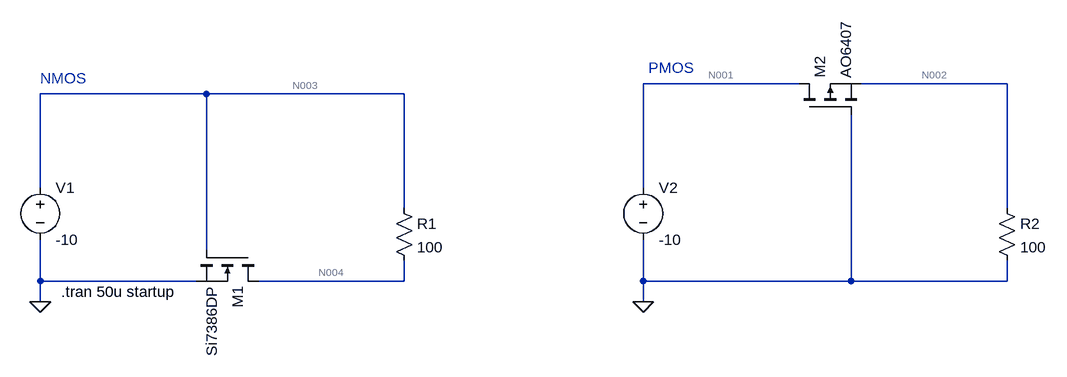
[diagram p0: schematic mosfet-battery-proctection.asc]
mosfet-battery-proctection.asc, the LTspice schematic file:
Version 4
SHEET 1 1508 680
WIRE 1120 16 880 16
WIRE 1440 16 1216 16
WIRE 208 32 -48 32
WIRE 512 32 208 32
WIRE -48 176 -48 32
WIRE 880 176 880 16
WIRE 512 208 512 32
WIRE 1440 208 1440 16
WIRE 208 272 208 32
WIRE -48 320 -48 256
WIRE 192 320 -48 320
WIRE 512 320 512 288
WIRE 512 320 288 320
WIRE 880 320 880 256
WIRE 1200 320 1200 64
WIRE 1200 320 880 320
WIRE 1440 320 1440 288
WIRE 1440 320 1200 320
WIRE -48 352 -48 320
WIRE 880 352 880 320
FLAG -48 352 0
FLAG 880 352 0
SYMBOL nmos 288 272 R90
SYMATTR InstName M1
SYMATTR Value Si7386DP
SYMBOL res 496 192 R0
SYMATTR InstName R1
SYMATTR Value 100
SYMBOL voltage -48 160 R0
WINDOW 123 0 0 Left 0
WINDOW 39 0 0 Left 0
SYMATTR InstName V1
SYMATTR Value -10
SYMBOL res 1424 192 R0
SYMATTR InstName R2
SYMATTR Value 100
SYMBOL voltage 880 160 R0
WINDOW 123 0 0 Left 0
WINDOW 39 0 0 Left 0
SYMATTR InstName V2
SYMATTR Value -10
SYMBOL pmos 1120 64 R270
SYMATTR InstName M2
SYMATTR Value AO6407
TEXT -16 336 Left 2 !.tran 50u startup
TEXT 888 -8 Left 2 ;PMOS
TEXT -48 8 Left 2 ;NMOS

The netlist it stands for:
* mosfet-battery-proctection.asc
M1 N004 N003 0 0 Si7386DP
R1 N003 N004 100
V1 N003 0 -10
R2 N002 0 100
V2 N001 0 -10
M2 N001 0 N002 N002 AO6407
.model NMOS NMOS
.model PMOS PMOS
.lib standard.mos
.tran 50u startup
* PMOS
* NMOS
.backanno
.end

* Results of the author's LTspice run, read from the files saved beside the schematic
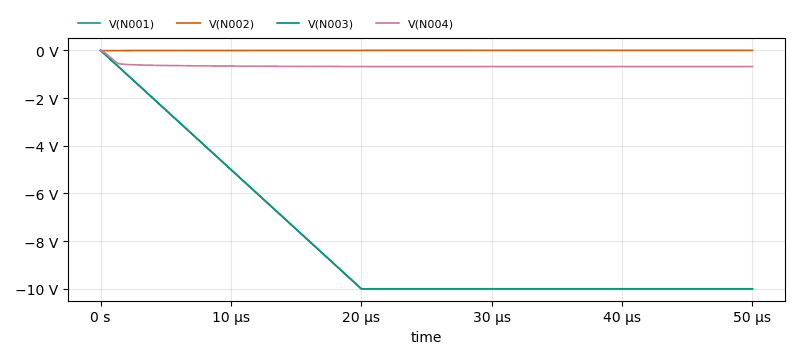
[diagram p1: Transient Analysis of mosfet-battery-proctection.asc, plotted from the saved traces]
* Transient Analysis, 1 run:
*   V(N001): min -10 V, max 0 V, average -8 V, rms 8.569 V, last -10 V
*   V(N002): min -11.82 mV, max 0 V, average -2.416 mV, rms 4.014 mV, last -1.804 µV
*   V(N003): min -10 V, max 0 V, average -8 V, rms 8.569 V, last -10 V
*   V(N004): min -679.7 mV, max 0 V, average -658.2 mV, rms 662.4 mV, last -679.7 mV